# EasyEDA Pro project ProPrj_主车电路板.epro, schematic Schematic1
Board Name: 24V电源板; Create Date: 2025-03-27; Page Name: P1; Project Name: 主车电路板3.0; Schematic Name: Schematic1; Update Date: 2025-03-31; Company: 嘉立创EDA; Drawed: 李子晞; Page Size: A4; Version: V1.0
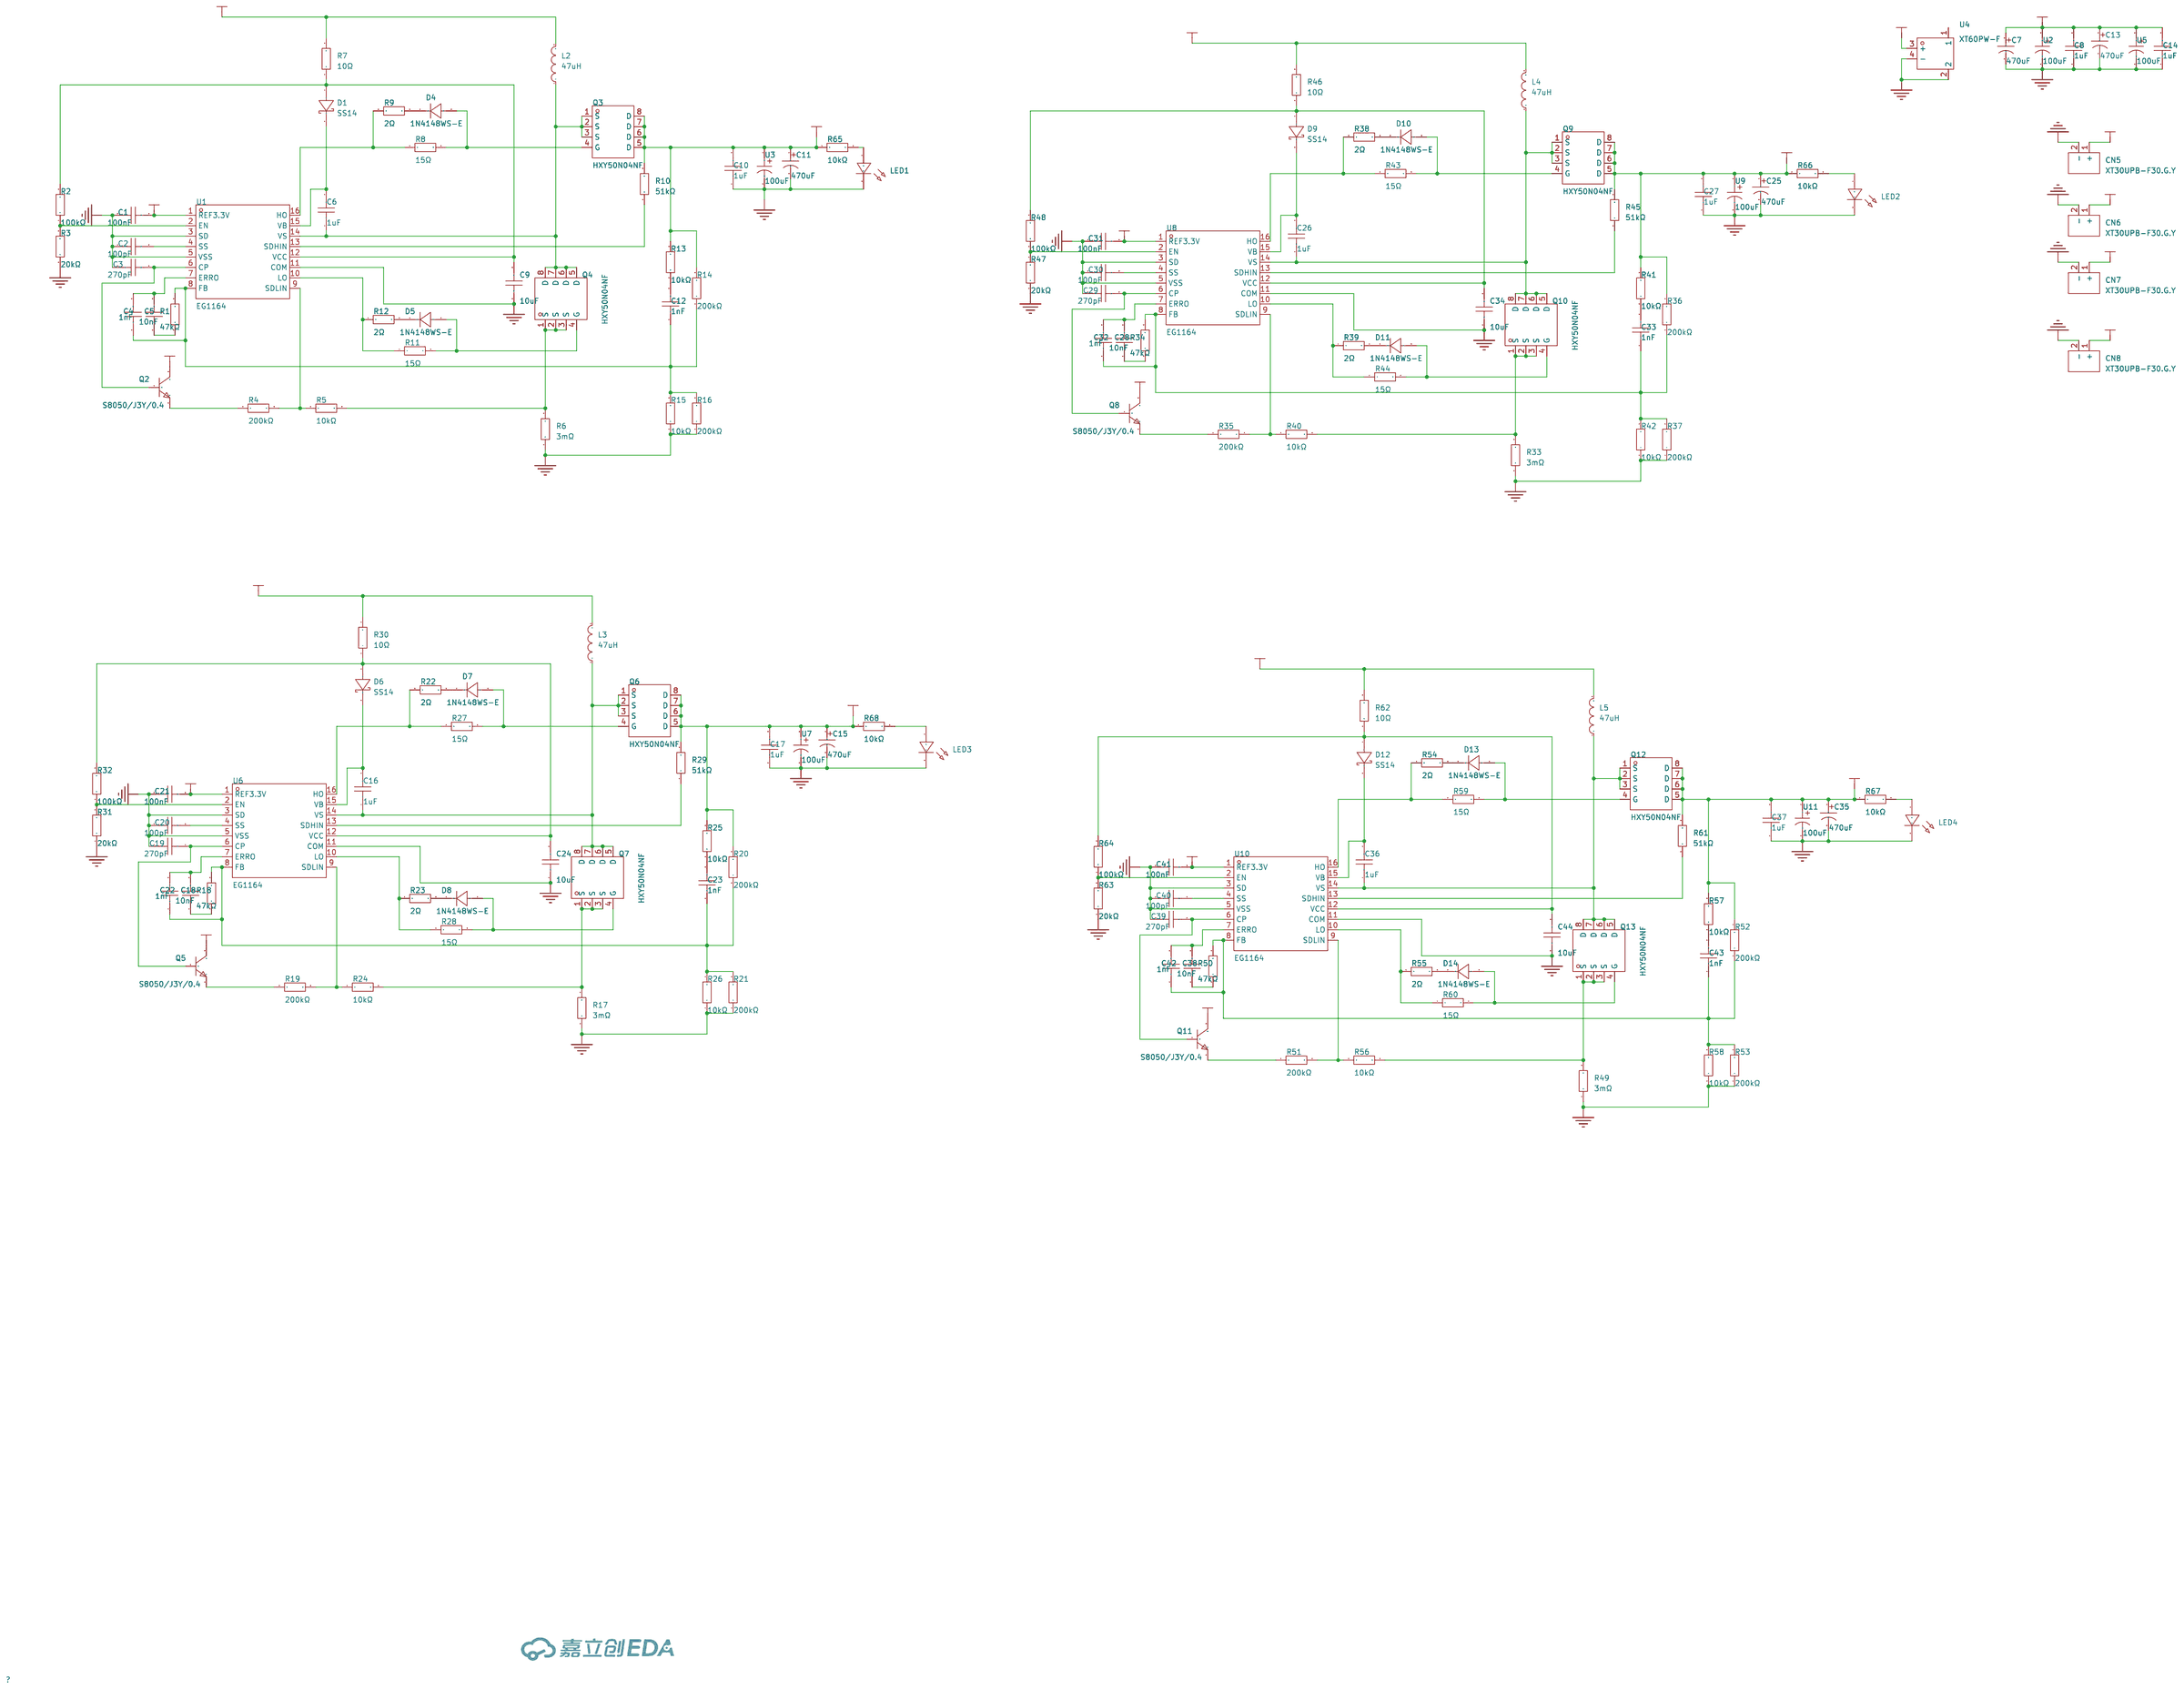
[diagram p1: schematic sheet]

## Parts
C1  100nF  [C0805]
C2  100pF  [C0805]
C3  270pF  [C0805]
C4  1nF  [C0805]
C5  10nF  [C0805]
C6  1uF  [C0805]
C7  470uF  [CAP-SMD_BD10.0-L10.3-W10.3-LS11.0-R-RD]
C8  1uF  [C0805]
C9  10uF  [C0805]
C10  1uF  [C0805]
C11  470uF  [CAP-SMD_BD10.0-L10.3-W10.3-LS11.0-R-RD]
C12  1nF  [C0805]
C13  470uF  [CAP-SMD_BD10.0-L10.3-W10.3-LS11.0-R-RD]
C14  1uF  [C0805]
C15  470uF  [CAP-SMD_BD10.0-L10.3-W10.3-LS11.0-R-RD]
C16  1uF  [C0805]
C17  1uF  [C0805]
C18  10nF  [C0805]
C19  270pF  [C0805]
C20  100pF  [C0805]
C21  100nF  [C0805]
C22  1nF  [C0805]
C23  1nF  [C0805]
C24  10uF  [C0805]
C25  470uF  [CAP-SMD_BD10.0-L10.3-W10.3-LS11.0-R-RD]
C26  1uF  [C0805]
C27  1uF  [C0805]
C28  10nF  [C0805]
C29  270pF  [C0805]
C30  100pF  [C0805]
C31  100nF  [C0805]
C32  1nF  [C0805]
C33  1nF  [C0805]
C34  10uF  [C0805]
C35  470uF  [CAP-SMD_BD10.0-L10.3-W10.3-LS11.0-R-RD]
C36  1uF  [C0805]
C37  1uF  [C0805]
C38  10nF  [C0805]
C39  270pF  [C0805]
C40  100pF  [C0805]
C41  100nF  [C0805]
C42  1nF  [C0805]
C43  1nF  [C0805]
C44  10uF  [C0805]
CN5  XT30UPB-F30.G.Y  [CONN-TH_XT30UPB-F]
CN6  XT30UPB-F30.G.Y  [CONN-TH_XT30UPB-F]
CN7  XT30UPB-F30.G.Y  [CONN-TH_XT30UPB-F]
CN8  XT30UPB-F30.G.Y  [CONN-TH_XT30UPB-F]
D1  SS14  [DO-214AC_L5.0-W2.5-LS5.0-FD]
D4  1N4148WS-E  [SOD-323_L1.8-W1.3-LS2.5-RD]
D5  1N4148WS-E  [SOD-323_L1.8-W1.3-LS2.5-RD]
D6  SS14  [DO-214AC_L5.0-W2.5-LS5.0-FD]
D7  1N4148WS-E  [SOD-323_L1.8-W1.3-LS2.5-RD]
D8  1N4148WS-E  [SOD-323_L1.8-W1.3-LS2.5-RD]
D9  SS14  [DO-214AC_L5.0-W2.5-LS5.0-FD]
D10  1N4148WS-E  [SOD-323_L1.8-W1.3-LS2.5-RD]
D11  1N4148WS-E  [SOD-323_L1.8-W1.3-LS2.5-RD]
D12  SS14  [DO-214AC_L5.0-W2.5-LS5.0-FD]
D13  1N4148WS-E  [SOD-323_L1.8-W1.3-LS2.5-RD]
D14  1N4148WS-E  [SOD-323_L1.8-W1.3-LS2.5-RD]
L2  47uH  [IND-TH_L20.0-W9.0-P8.00-D1.0]
L3  47uH  [IND-TH_L20.0-W9.0-P8.00-D1.0]
L4  47uH  [IND-TH_L20.0-W9.0-P8.00-D1.0]
L5  47uH  [IND-TH_L20.0-W9.0-P8.00-D1.0]
LED1  -  [LED_TH-3mm]
LED2  -  [LED_TH-3mm]
LED3  -  [LED_TH-3mm]
LED4  -  [LED_TH-3mm]
Q2  S8050/J3Y/0.4  [SOT-23-3_L2.9-W1.3-P1.90-LS2.4-BR]
Q3  HXY50N04NF  [PDFN-8_L6.0-W5.0-P1.27-BL-A]
Q4  HXY50N04NF  [PDFN-8_L6.0-W5.0-P1.27-BL-A]
Q5  S8050/J3Y/0.4  [SOT-23-3_L2.9-W1.3-P1.90-LS2.4-BR]
Q6  HXY50N04NF  [PDFN-8_L6.0-W5.0-P1.27-BL-A]
Q7  HXY50N04NF  [PDFN-8_L6.0-W5.0-P1.27-BL-A]
Q8  S8050/J3Y/0.4  [SOT-23-3_L2.9-W1.3-P1.90-LS2.4-BR]
Q9  HXY50N04NF  [PDFN-8_L6.0-W5.0-P1.27-BL-A]
Q10  HXY50N04NF  [PDFN-8_L6.0-W5.0-P1.27-BL-A]
Q11  S8050/J3Y/0.4  [SOT-23-3_L2.9-W1.3-P1.90-LS2.4-BR]
Q12  HXY50N04NF  [PDFN-8_L6.0-W5.0-P1.27-BL-A]
Q13  HXY50N04NF  [PDFN-8_L6.0-W5.0-P1.27-BL-A]
R1  47kΩ  [R0805]
R2  100kΩ  [R0805_NEW]
R3  20kΩ  [R0805]
R4  200kΩ  [R0805]
R5  10kΩ  [R0805]
R6  3mΩ  [R1206]
R7  10Ω  [R0805]
R8  15Ω  [R0805]
R9  2Ω  [R0805]
R10  51kΩ  [R0805]
R11  15Ω  [R0805]
R12  2Ω  [R0805]
R13  10kΩ  [R0805]
R14  200kΩ  [R0805]
R15  10kΩ  [R0805]
R16  200kΩ  [R0805]
R17  3mΩ  [R1206]
R18  47kΩ  [R0805]
R19  200kΩ  [R0805]
R20  200kΩ  [R0805]
R21  200kΩ  [R0805]
R22  2Ω  [R0805]
R23  2Ω  [R0805]
R24  10kΩ  [R0805]
R25  10kΩ  [R0805]
R26  10kΩ  [R0805]
R27  15Ω  [R0805]
R28  15Ω  [R0805]
R29  51kΩ  [R0805]
R30  10Ω  [R0805]
R31  20kΩ  [R0805]
R32  100kΩ  [R0805_NEW]
R33  3mΩ  [R1206]
R34  47kΩ  [R0805]
R35  200kΩ  [R0805]
R36  200kΩ  [R0805]
R37  200kΩ  [R0805]
R38  2Ω  [R0805]
R39  2Ω  [R0805]
R40  10kΩ  [R0805]
R41  10kΩ  [R0805]
R42  10kΩ  [R0805]
R43  15Ω  [R0805]
R44  15Ω  [R0805]
R45  51kΩ  [R0805]
R46  10Ω  [R0805]
R47  20kΩ  [R0805]
R48  100kΩ  [R0805_NEW]
R49  3mΩ  [R1206]
R50  47kΩ  [R0805]
R51  200kΩ  [R0805]
R52  200kΩ  [R0805]
R53  200kΩ  [R0805]
R54  2Ω  [R0805]
R55  2Ω  [R0805]
R56  10kΩ  [R0805]
R57  10kΩ  [R0805]
R58  10kΩ  [R0805]
R59  15Ω  [R0805]
R60  15Ω  [R0805]
R61  51kΩ  [R0805]
R62  10Ω  [R0805]
R63  20kΩ  [R0805]
R64  100kΩ  [R0805_NEW]
R65  10kΩ  [R1206]
R66  10kΩ  [R1206]
R67  10kΩ  [R1206]
R68  10kΩ  [R1206]
U1  EG1164  [SOP-16_L9.9-W3.9-P1.27-LS6.0-BL]
U2  100uF  [CAP-SMD_BD6.3-L6.6-W6.6-LS7.2-FD]
U3  100uF  [CAP-SMD_BD6.3-L6.6-W6.6-LS7.2-FD]
U4  XT60PW-F  [TH_2P-XT60PW-F]
U5  100uF  [CAP-SMD_BD6.3-L6.6-W6.6-LS7.2-FD]
U6  EG1164  [SOP-16_L9.9-W3.9-P1.27-LS6.0-BL]
U7  100uF  [CAP-SMD_BD6.3-L6.6-W6.6-LS7.2-FD]
U8  EG1164  [SOP-16_L9.9-W3.9-P1.27-LS6.0-BL]
U9  100uF  [CAP-SMD_BD6.3-L6.6-W6.6-LS7.2-FD]
U10  EG1164  [SOP-16_L9.9-W3.9-P1.27-LS6.0-BL]
U11  100uF  [CAP-SMD_BD6.3-L6.6-W6.6-LS7.2-FD]

## Library data of the parts
C1 C21 C31 C41 = CC0805KRX7R9BB104: 容值:100nF;精度:±10%;额定电压:50V;材质(温度系数):X7R;; LCSC Part Name: 100nF ±10% 50V; Supplier Part: C49678; Manufacturer: YAGEO(国巨); Supplier Footprint: 0805; JLCPCB Part Class: Basic Part; Datasheet: https://atta.szlcsc.com/upload/public/pdf/source/20180224/C181747_15194369449651363981.pdf; Supplier: LCSC; Tolerance: ±10%; Voltage Rated: 50V; Temperature Coefficient: X7R
C2 C20 C30 C40 = CC0805JRNPO9BN101: 容值:100pF;精度:±5%;额定电压:50V;材质(温度系数):NP0;; LCSC Part Name: 100pF ±5% 50V; Supplier Part: C62768; Manufacturer: YAGEO(国巨); Supplier Footprint: 0805; JLCPCB Part Class: Extended Part; Datasheet: https://atta.szlcsc.com/upload/public/pdf/source/20170505/1493957838062.pdf; Supplier: LCSC; Tolerance: ±5%; Voltage Rated: 50V; Temperature Coefficient: NP0
C3 C19 C29 C39 = CC0805JRNPO9BN271: 容值:270pF;精度:±5%;额定电压:50V;材质(温度系数):NP0;; LCSC Part Name: 270pF ±5% 50V; Supplier Part: C113828; Manufacturer: YAGEO(国巨); Supplier Footprint: 0805; JLCPCB Part Class: Extended Part; Datasheet: https://atta.szlcsc.com/upload/public/pdf/source/20170914/C128857_1505359892143968080.pdf; Supplier: LCSC; Tolerance: ±5%; Voltage Rated: 50V; Temperature Coefficient: NP0
C4 C12 C22 C23 C32 C33 C42 C43 = CC0805KRX7R9BB102: 容值:1nF;精度:±10%;额定电压:50V;材质(温度系数):X7R;; LCSC Part Name: 1nF ±10% 50V; Supplier Part: C94121; Manufacturer: YAGEO(国巨); Supplier Footprint: 0805; JLCPCB Part Class: Extended Part; Datasheet: https://atta.szlcsc.com/upload/public/pdf/source/20170211/1486785656773.pdf; Supplier: LCSC; Tolerance: ±10%; Voltage Rated: 50V; Temperature Coefficient: X7R
C5 C18 C28 C38 = CC0805KRX7R9BB103: 容值:10nF;精度:±10%;额定电压:50V;材质(温度系数):X7R;; LCSC Part Name: 10nF ±10% 50V; Supplier Part: C83170; Manufacturer: YAGEO(国巨); Supplier Footprint: 0805; JLCPCB Part Class: Extended Part; Datasheet: https://atta.szlcsc.com/upload/public/pdf/source/20170211/1486785656773.pdf; Supplier: LCSC; Tolerance: ±10%; Voltage Rated: 50V; Temperature Coefficient: X7R
C6 C8 C10 C14 C16 C17 C26 C27 C36 C37 = CC0805KKX7R9BB105: 容值:1uF;精度:±10%;额定电压:50V;材质(温度系数):X7R;; LCSC Part Name: 1uF ±10% 50V; Supplier Part: C91185; Manufacturer: YAGEO(国巨); Supplier Footprint: 0805; JLCPCB Part Class: Extended Part; Datasheet: https://atta.szlcsc.com/upload/public/pdf/source/20181008/C309510_22F155564471FAF6A489F7D68F34234E.pdf; Supplier: LCSC; Tolerance: ±10%; Voltage Rated: 50V; Temperature Coefficient: X7R
C7 C11 C13 C15 C25 C35 = RVT1V471M1010_C72519: 容值:470uF;精度:±20%;额定电压:35V;纹波电流:286mA@120Hz;等效串联电阻(ESR):-;; LCSC Part Name: 470uF ±20% 35V; Supplier Part: C72519; Manufacturer: ROQANG(容强); Manufacturer Part: RVT1V471M1010; Supplier Footprint: SMD,D10xL10.2mm; JLCPCB Part Class: Extended Part; Datasheet: https://atta.szlcsc.com/upload/public/pdf/source/20210128/C72519_A1B8ED607B11AD36B70B1D23AFC8819E.pdf; Supplier: LCSC; Tolerance: ±20%; Voltage Rating: 35V; Ripple Current: 286mA@120Hz; Diameter: 10mm; Height - Seated (Max): 10.2mm; Lifetime: 2000hrs@105℃; Operating Temperature: -40℃~+105℃
C9 C24 C34 C44 = GRM21BR61H106KE43L: 容值:10uF;精度:±10%;额定电压:50V;材质(温度系数):X5R;; LCSC Part Name: 10uF ±10% 50V; Supplier Part: C440198; Manufacturer: muRata(村田); Supplier Footprint: 0805; JLCPCB Part Class: Basic Part; Datasheet: https://atta.szlcsc.com/upload/public/pdf/source/20230811/95AAE0C9AF55EDC31B7A4D8B733F534E.pdf; Supplier: LCSC; Tolerance: ±10%; Voltage Rated: 50V; Temperature Coefficient: X5R
CN5-CN8 = XT30UPB-F30.G.Y: 类别:-;类型1:-;; LCSC Part Name: AMASS(艾迈斯)直立焊板式连接器XT30UPB30-F.G.*; Supplier Part: C108769; Manufacturer: AMASS(艾迈斯); JLCPCB Part Class: 扩展库; Datasheet: https://atta.szlcsc.com/upload/public/pdf/source/20220715/AFD68B9E8B6CA95A7295DBF4AF9325E4.pdf; Supplier: LCSC; Brand: 艾迈斯; Type: 航模插头; Colour: 黄色; RatedVoltage: DC 500V; InterfaceType: 母头; MetalMaterial: 镀金; InsulationMaterial: PA; RatedCurrent: 15A; contact resistance: 0.65mΩ
D1 D6 D9 D12 = SS14_C509048: 正向压降(Vf):550mV@1A;直流反向耐压(Vr):40V;平均整流电流(Io):1A;; LCSC Part Name: 电压:40V 电流:1A; Supplier Part: C509048; Manufacturer: Hottech(合科泰); Supplier Footprint: SMA(DO-214AC); JLCPCB Part Class: 扩展库; Datasheet: https://atta.szlcsc.com/upload/public/pdf/source/20220428/2BFFD78FFB6595E0D7CF7645C4176133.pdf; Supplier: LCSC; Forward Voltage (Vf@If): 550mV@1A; Reverse Voltage (Vr): 40V; Average Rectified Current (Io): 1A; Reverse Leakage Current (Ir): 500uA@40V
D4 D5 D7 D8 D10 D11 D13 D14 = 1N4148WS-E: 二极管配置:-;正向压降(Vf):-;直流反向耐压(Vr):-;; LCSC Part Name: 开关二极管; Supplier Part: C41371421; Manufacturer: MDD(辰达半导体); Supplier Footprint: SOD-323; JLCPCB Part Class: 扩展库; Datasheet: https://atta.szlcsc.com/upload/public/pdf/source/20240830/BA1E56105C5798AA4D5522D8577BF8A0.pdf; Supplier: LCSC
L2-L5 = XR065125T470MV1L: 电感值:47uH;精度:±10%;额定电流:7.8A;类型:磁环电感;; Supplier Part: C18213929; Manufacturer: XR(祥如); Supplier Footprint: 插件,D=20mm; JLCPCB Part Class: Extended Part; Datasheet: https://atta.szlcsc.com/upload/public/pdf/source/20231010/842403E5F9633A96AB1B00766EE4450D.pdf; Supplier: LCSC; Tolerance: ±10%; Rated Current: 7.8A; Type: 磁环电感; Wire Diameter: 1mm
LED1-LED4 = LED_TH-R_3mm: Supplier Footprint: 插件
Q2 Q5 Q8 Q11 = S8050/J3Y/0.4: 晶体管类型:NPN;集电极电流(Ic):500mA;集射极击穿电压(Vceo):25V;耗散功率(Pd):-;直流电流增益(hFE):400@100mA,1V;; Supplier Part: C5143141; Manufacturer: MOT(仁懋); Supplier Footprint: SOT-23; JLCPCB Part Class: 扩展库; Datasheet: https://atta.szlcsc.com/upload/public/pdf/source/20240219/78A732D43FD61A04D5C1F4B38FCBE817.pdf; Supplier: LCSC; type: NPN; Current - Collector(Ic): 500mA; Collector - Emitter Voltage VCEO: 25V; DC Current Gain: 400@100mA,1V; Transition frequency(fT): 100MHz; Current - Collector Cutoff: 100nA; Vce Saturation(VCE(sat)): 600mV
Q3 Q4 Q6 Q7 Q9 Q10 Q12 Q13 = HXY50N04NF: 类型:1个N沟道;漏源电压(Vdss):40V;连续漏极电流(Id):50A;导通电阻(RDS(on)@Vgs,Id):14mΩ@10V,30A;阈值电压(Vgs(th)@Id):2.5V@250uA;; LCSC Part Name: N沟道增强型MOSFET,电流:50A,耐压:40V; Supplier Part: C3033451; Manufacturer: HXY MOSFET(华轩阳电子); Supplier Footprint: DFN-8L(5x6); JLCPCB Part Class: 扩展库; Datasheet: https://atta.szlcsc.com/upload/public/pdf/source/20221215/433928C2BDB69DFDF4E8595FEF01B3C6.pdf; Supplier: LCSC; Type: 1个N沟道; Drain Source Voltage (Vdss): 40V; Continuous Drain Current (Id): 50A; Drain Source On Resistance (RDS(on)@Vgs,Id): 14mΩ@10V,30A; Gate Threshold Voltage (Vgs(th)@Id): 2.5V@250uA; Total Gate Charge (Qg@Vgs): 24nC; Input Capacitance (Ciss@Vds): 1.54nF@25V; Reverse Transfer Capacitance (Crss@Vds): 115pF; Operating Temperature: -55℃~+175℃
R1 R18 R34 R50 = 0805W8F4702T5E: 电阻类型:厚膜电阻;阻值:47kΩ;精度:±1%;功率:125mW;最大工作电压:150V;温度系数:±100ppm/℃;; LCSC Part Name: 47kΩ ±1% 125mW 厚膜电阻; Supplier Part: C17713; Manufacturer: UNI-ROYAL(厚声); Supplier Footprint: 0805; JLCPCB Part Class: Basic Part; Datasheet: https://atta.szlcsc.com/upload/public/pdf/source/20200306/C422600_1E6D84923E4A46A82E41ADD87F860B5C.pdf; Supplier: LCSC; Type: 厚膜电阻; Tolerance: ±1%; Power(Watts): 125mW; Overload Voltage (Max): 150V; Temperature Coefficient: ±100ppm/℃; Operating Temperature Range: -55℃~+155℃
R2 R32 R48 R64 = RC0805FR-07100KL: 电阻类型:厚膜电阻;阻值:100kΩ;精度:±1%;功率:125mW;最大工作电压:150V;温度系数:±100ppm/℃;; LCSC Part Name: 厚膜电阻 100kΩ ±1% 125mW; Supplier Part: C96346; Manufacturer: YAGEO(国巨); Supplier Footprint: 0805; JLCPCB Part Class: Extended Part; Datasheet: https://atta.szlcsc.com/upload/public/pdf/source/20170708/1499509500945.pdf; Supplier: LCSC; Type: 厚膜电阻; Tolerance: ±1%; Power(Watts): 125mW; Overload Voltage (Max): 150V; Temperature Coefficient: ±100ppm/℃; Operating Temperature Range: -55℃~+155℃
R3 R31 R47 R63 = RC0805FR-0720KL: 电阻类型:厚膜电阻;阻值:20kΩ;精度:±1%;功率:125mW;最大工作电压:150V;温度系数:±100ppm/℃;; LCSC Part Name: 厚膜电阻 20kΩ ±1% 125mW; Supplier Part: C114566; Manufacturer: YAGEO(国巨); Supplier Footprint: 0805; JLCPCB Part Class: Extended Part; Datasheet: https://atta.szlcsc.com/upload/public/pdf/source/20180821/C275644_0D56F95EFF785E7D9A1FEF436B37DA78.pdf; Supplier: LCSC; Type: 厚膜电阻; Tolerance: ±1%; Power(Watts): 125mW; Overload Voltage (Max): 150V; Temperature Coefficient: ±100ppm/℃; Operating Temperature Range: -55℃~+155℃
R4 R14 R16 R19-R21 R35-R37 R51-R53 = RC0805FR-07200KL: 电阻类型:厚膜电阻;阻值:200kΩ;精度:±1%;功率:125mW;最大工作电压:150V;温度系数:±100ppm/℃;; LCSC Part Name: 厚膜电阻 200kΩ ±1% 125mW; Supplier Part: C114562; Manufacturer: YAGEO(国巨); Supplier Footprint: 0805; JLCPCB Part Class: Extended Part; Datasheet: https://atta.szlcsc.com/upload/public/pdf/source/20180821/C275644_0D56F95EFF785E7D9A1FEF436B37DA78.pdf; Supplier: LCSC; Type: 厚膜电阻; Tolerance: ±1%; Power(Watts): 125mW; Overload Voltage (Max): 150V; Temperature Coefficient: ±100ppm/℃; Operating Temperature Range: -55℃~+155℃
R5 R13 R15 R24-R26 R40-R42 R56-R58 = RC0805FR-0710KL: 电阻类型:厚膜电阻;阻值:10kΩ;精度:±1%;功率:125mW;最大工作电压:150V;温度系数:±100ppm/℃;; LCSC Part Name: 厚膜电阻 10kΩ ±1% 125mW; Supplier Part: C84376; Manufacturer: YAGEO(国巨); Supplier Footprint: 0805; JLCPCB Part Class: Extended Part; Datasheet: https://atta.szlcsc.com/upload/public/pdf/source/20170708/1499509500945.pdf; Supplier: LCSC; Type: 厚膜电阻; Tolerance: ±1%; Power(Watts): 125mW; Overload Voltage (Max): 150V; Temperature Coefficient: ±100ppm/℃; Operating Temperature Range: -55℃~+155℃
R6 R17 R33 R49 = HoLR1206-1W-3mR-1%-75ppm: 电阻类型:采样电阻;阻值:3mΩ;精度:±1%;功率:1W;温度系数:±75ppm/℃;安装方式:贴片;; LCSC Part Name: 3mΩ ±1% 1W; Supplier Part: C601095; Manufacturer: Milliohm(毫欧); Supplier Footprint: 1206; JLCPCB Part Class: Extended Part; Datasheet: https://atta.szlcsc.com/upload/public/pdf/source/20200610/C601095_3D352933543F6BA76746E7FBED6185DD.pdf; Supplier: LCSC; Type: 采样电阻; Tolerance: ±1%; Power(Watts): 1W; Temperature Coefficient: ±75ppm/℃; Mounting Sytle: 贴片
R7 R30 R46 R62 = RC0805FR-0710RL: 电阻类型:厚膜电阻;阻值:10Ω;精度:±1%;功率:125mW;最大工作电压:150V;温度系数:±200ppm/℃;; LCSC Part Name: 厚膜电阻 10Ω ±1% 125mW; Supplier Part: C96347; Manufacturer: YAGEO(国巨); Supplier Footprint: 0805; JLCPCB Part Class: Extended Part; Datasheet: https://atta.szlcsc.com/upload/public/pdf/source/20170815/C125758_1502799027253889202.pdf; Supplier: LCSC; Type: 厚膜电阻; Tolerance: ±1%; Power(Watts): 125mW; Overload Voltage (Max): 150V; Temperature Coefficient: ±200ppm/℃; Operating Temperature Range: -55℃~+155℃
R8 R11 R27 R28 R43 R44 R59 R60 = RT0805BRE0715RL: 电阻类型:薄膜电阻;阻值:15Ω;精度:±0.1%;功率:125mW;最大工作电压:150V;温度系数:±50ppm/℃;; LCSC Part Name: 薄膜电阻 15Ω ±0.1% 125mW; Supplier Part: C706259; Manufacturer: YAGEO(国巨); Supplier Footprint: 0805; JLCPCB Part Class: Extended Part; Datasheet: https://atta.szlcsc.com/upload/public/pdf/source/20200720/C706259_2F2301666A28980AE85D5687CDDC0A3F.pdf; Supplier: LCSC; Type: 薄膜电阻; Tolerance: ±0.1%; Power(Watts): 125mW; Overload Voltage (Max): 150V; Temperature Coefficient: ±50ppm/℃; Operating Temperature Range: -55℃~+155℃
R9 R12 R22 R23 R38 R39 R54 R55 = RC0805FR-072RL: 电阻类型:厚膜电阻;阻值:2Ω;精度:±1%;功率:125mW;最大工作电压:150V;温度系数:±200ppm/℃;; LCSC Part Name: 厚膜电阻 2Ω ±1% 125mW; Supplier Part: C114246; Manufacturer: YAGEO(国巨); Supplier Footprint: 0805; JLCPCB Part Class: Extended Part; Datasheet: https://atta.szlcsc.com/upload/public/pdf/source/20180821/C275644_0D56F95EFF785E7D9A1FEF436B37DA78.pdf; Supplier: LCSC; Type: 厚膜电阻; Tolerance: ±1%; Power(Watts): 125mW; Overload Voltage (Max): 150V; Temperature Coefficient: ±200ppm/℃; Operating Temperature Range: -55℃~+155℃
R10 R29 R45 R61 = RC0805FR-0751KL: 电阻类型:厚膜电阻;阻值:51kΩ;精度:±1%;功率:125mW;最大工作电压:150V;温度系数:±100ppm/℃;; LCSC Part Name: 厚膜电阻 51kΩ ±1% 125mW; Supplier Part: C107233; Manufacturer: YAGEO(国巨); Supplier Footprint: 0805; JLCPCB Part Class: Extended Part; Datasheet: https://atta.szlcsc.com/upload/public/pdf/source/20180821/C275644_0D56F95EFF785E7D9A1FEF436B37DA78.pdf; Supplier: LCSC; Type: 厚膜电阻; Tolerance: ±1%; Power(Watts): 125mW; Overload Voltage (Max): 150V; Temperature Coefficient: ±100ppm/℃; Operating Temperature Range: -55℃~+155℃
R65-R68 = FRP1206J103 TS: 电阻类型:厚膜电阻;阻值:10kΩ;精度:±5%;功率:500mW;最大工作电压:200V;温度系数:±200ppm/℃;; LCSC Part Name: 10kΩ ±5% 500mW 厚膜电阻; Supplier Part: C3013377; Manufacturer: FOJAN(富捷); Supplier Footprint: 1206; JLCPCB Part Class: Extended Part; Datasheet: https://atta.szlcsc.com/upload/public/pdf/source/20211221/925EC7D7225764EE0046F22065062C87.pdf; Supplier: LCSC; Type: 厚膜电阻; Tolerance: ±5%; Power(Watts): 500mW; Overload Voltage (Max): 200V; Temperature Coefficient: ±200ppm/℃
U1 U6 U8 U10 = EG1164: 功能类型:升压型;输出类型:-;工作电压:-;输出电压:-;输出电流:-;; LCSC Part Name: 升压型同步整流电源芯片; Supplier Part: C2987434; Manufacturer: EG(屹晶微); Supplier Footprint: SOP-16; JLCPCB Part Class: 扩展库; Datasheet: https://atta.szlcsc.com/upload/public/pdf/source/20220331/0031AB6D1B81CE74DEC4FA72EA357130.pdf; Supplier: LCSC; Function: 升压型; Operating Temperature: -45℃~+125℃; Synchronous Rectification: 是; Number of Outputs: 1; Topology: 升压式
U2 = RST100UF35V009: 容值:100uF;精度:±20%;额定电压:35V;纹波电流:84mA@120Hz;等效串联电阻(ESR):-;; LCSC Part Name: 100uF ±20% 35V; Supplier Part: C4747966; Manufacturer: KNSCHA(科尼盛); Supplier Footprint: SMD,D6.3xL7.7mm; JLCPCB Part Class: Extended Part; Datasheet: https://atta.szlcsc.com/upload/public/pdf/source/20220728/EE5FCA44287011E134FD5BDD3E8B91F9.pdf; Supplier: LCSC; Tolerance: ±20%; Voltage Rating: 35V; Ripple Current: 84mA@120Hz; Diameter: 6.3mm; Height - Seated (Max): 7.7mm; Lifetime: 2000hrs@105℃; Operating Temperature: -40℃~+105℃
U3 U5 U7 U9 U11 = RST100UF35V009: 容值:100uF;精度:±20%;额定电压:35V;纹波电流:84mA@120Hz;等效串联电阻(ESR):-;; LCSC Part Name: 100uF ±20% 35V; Supplier Part: C4747966; Manufacturer: KNSCHA(科尼盛); Supplier Footprint: SMD,D6.3xL7.7mm; JLCPCB Part Class: 扩展库; Datasheet: https://atta.szlcsc.com/upload/public/pdf/source/20220728/EE5FCA44287011E134FD5BDD3E8B91F9.pdf; Supplier: LCSC; Tolerance: ±20%; Voltage Rating: 35V; Ripple Current: 84mA@120Hz; Diameter: 6.3mm; Height - Seated (Max): 7.7mm; Lifetime: 2000hrs@105℃; Operating Temperature: -40℃~+105℃
U4 = XT60PW-F: 类别:-;类型1:-;; LCSC Part Name: AMASS(艾迈斯)插头连接器锂电池组充电接口 航模电调卧式焊板 母头 XT60PW-F; Supplier Part: C428722; Manufacturer: AMASS(艾迈斯); JLCPCB Part Class: 扩展库; Datasheet: https://atta.szlcsc.com/upload/public/pdf/source/20190916/C428722_DFF78979486FCB0B58C1FC563067EC88.pdf; Supplier: LCSC; Type: 卧式插头; Colour: 黄色; InterfaceType: 母头

## Nets
+3.3V: C1.2 Q2.3(C) U1.1(REF3.3V)
+16.8V: C7.1 C8.2 C13.1 C14.2 L2.2 L3.2 L4.2 L5.2 R7.2 R30.2 R46.2 R62.2 U2.1 U4.3(+) U5.1
GND: C1.1 C2.1 C3.1 C7.2 C8.1 C9.1 C10.1 C11.2 C13.2 C14.1 C15.2 C17.1 C19.1 C20.1 C21.1 C24.1 C25.2 C27.1 C29.1 C30.1 C31.1 C34.1 C35.2 C37.1 C39.1 C40.1 C41.1 C44.1 CN5.2(-) CN6.2(-) CN7.2(-) CN8.2(-) LED1.2(A) LED2.2(A) LED3.2(A) LED4.2(A) R3.1 R6.1 R15.1 R16.1 R17.1 R21.1 R26.1 R31.1 R33.1 R37.1 R42.1 R47.1 R49.1 R53.1 R58.1 R63.1 U1.3(SD) U1.5(VSS) U1.11(COM) U2.2 U3.2 U4.2 U4.4(-) U5.2 U6.3(SD) U6.5(VSS) U6.11(COM) U7.2 U8.3(SD) U8.5(VSS) U8.11(COM) U9.2 U10.3(SD) U10.5(VSS) U10.11(COM) U11.2
REF3.3V-2: C31.2 Q8.3(C) U8.1(REF3.3V)
REF3.3V-3: C21.2 Q5.3(C) U6.1(REF3.3V)
REF3.3V-4: C41.2 Q11.3(C) U10.1(REF3.3V)
VOUT1: C10.2 C11.1 CN5.1(+) Q3.5(D) Q3.6(D) Q3.7(D) Q3.8(D) R10.2 R13.2 R14.2 R65.1 U3.1
VOUT2: C25.1 C27.2 CN6.1(+) Q9.5(D) Q9.6(D) Q9.7(D) Q9.8(D) R36.2 R41.2 R45.2 R66.1 U9.1
VOUT3: C15.1 C17.2 CN7.1(+) Q6.5(D) Q6.6(D) Q6.7(D) Q6.8(D) R20.2 R25.2 R29.2 R68.1 U7.1
VOUT4: C35.1 C37.2 CN8.1(+) Q12.5(D) Q12.6(D) Q12.7(D) Q12.8(D) R52.2 R57.2 R61.2 R67.1 U11.1
$1N587: C2.2 U1.4(SS)
$1N613: C3.2 Q2.1(B) U1.6(CP)
$1N810: C4.2 C5.2 U1.7(ERRO)
$1N1003: C5.1 R1.1
$1N1020: R2.1 R3.2 U1.2(EN)
$1N1118: Q2.2(E) R4.1
$1N1194: R4.2 R5.1 U1.9(SDLIN)
$1N1198: Q4.1(S) Q4.2(S) Q4.3(S) R5.2 R6.2
$1N1234: C9.2 D1.1(A) R2.2 R7.1 U1.12(VCC)
$1N1468: C6.2 D1.2(K) U1.15(VB)
$1N1730: D4.1(K) R9.2
$1N2143: R8.1 R9.1 U1.16(HO)
$1N2257: D4.2(A) Q3.4(G) R8.2
$1N2454: C6.1 L2.1 Q3.1(S) Q3.2(S) Q3.3(S) Q4.5(D) Q4.6(D) Q4.7(D) Q4.8(D) U1.14(VS)
$1N2537: R10.1 U1.13(SDHIN)
$1N2739: D5.2(A) Q4.4(G) R11.2
$1N2745: R11.1 R12.1 U1.10(LO)
$1N2749: D5.1(K) R12.2
$1N3054: C12.2 R13.1
$1N3114: C4.1 C12.1 R1.2 R14.1 R15.2 R16.2 U1.8(FB)
$1N10505: C16.1 L3.1 Q6.1(S) Q6.2(S) Q6.3(S) Q7.5(D) Q7.6(D) Q7.7(D) Q7.8(D) U6.14(VS)
$1N10518: D7.2(A) Q6.4(G) R27.2
$1N10523: D7.1(K) R22.2
$1N10529: C24.2 D6.1(A) R30.1 R32.2 U6.12(VCC)
$1N10537: C23.2 R25.1
$1N10539: R29.1 U6.13(SDHIN)
$1N10542: Q7.1(S) Q7.2(S) Q7.3(S) R17.2 R24.2
$1N10551: D8.2(A) Q7.4(G) R28.2
$1N10557: R23.1 R28.1 U6.10(LO)
$1N10562: D8.1(K) R23.2
$1N10564: R19.2 R24.1 U6.9(SDLIN)
$1N10568: C22.1 C23.1 R18.2 R20.1 R21.2 R26.2 U6.8(FB)
$1N10586: R22.1 R27.1 U6.16(HO)
$1N10591: C16.2 D6.2(K) U6.15(VB)
$1N10609: Q5.2(E) R19.1
$1N10613: C18.2 C22.2 U6.7(ERRO)
$1N10618: C20.2 U6.4(SS)
$1N10620: C19.2 Q5.1(B) U6.6(CP)
$1N10634: R31.2 R32.1 U6.2(EN)
$1N10636: C18.1 R18.1
$1N12142: R38.1 R43.1 U8.16(HO)
$1N12147: C26.1 L4.1 Q9.1(S) Q9.2(S) Q9.3(S) Q10.5(D) Q10.6(D) Q10.7(D) Q10.8(D) U8.14(VS)
$1N12160: D10.2(A) Q9.4(G) R43.2
$1N12165: D10.1(K) R38.2
$1N12167: C29.2 Q8.1(B) U8.6(CP)
$1N12177: C26.2 D9.2(K) U8.15(VB)
$1N12190: Q10.1(S) Q10.2(S) Q10.3(S) R33.2 R40.2
$1N12195: C30.2 U8.4(SS)
$1N12199: C33.2 R41.1
$1N12201: R45.1 U8.13(SDHIN)
$1N12204: C34.2 D9.1(A) R46.1 R48.2 U8.12(VCC)
$1N12212: C28.2 C32.2 U8.7(ERRO)
$1N12217: C32.1 C33.1 R34.2 R36.1 R37.2 R42.2 U8.8(FB)
$1N12230: D11.2(A) Q10.4(G) R44.2
$1N12236: D11.1(K) R39.2
$1N12238: R39.1 R44.1 U8.10(LO)
$1N12243: C28.1 R34.1
$1N12250: Q8.2(E) R35.1
$1N12252: R35.2 R40.1 U8.9(SDLIN)
$1N12258: R47.2 R48.1 U8.2(EN)
$1N13775: R54.1 R59.1 U10.16(HO)
$1N13780: C36.1 L5.1 Q12.1(S) Q12.2(S) Q12.3(S) Q13.5(D) Q13.6(D) Q13.7(D) Q13.8(D) U10.14(VS)
$1N13793: D13.2(A) Q12.4(G) R59.2
$1N13798: D13.1(K) R54.2
$1N13800: C39.2 Q11.1(B) U10.6(CP)
$1N13810: C36.2 D12.2(K) U10.15(VB)
$1N13823: Q13.1(S) Q13.2(S) Q13.3(S) R49.2 R56.2
$1N13828: C40.2 U10.4(SS)
$1N13832: C43.2 R57.1
$1N13834: R61.1 U10.13(SDHIN)
$1N13837: C44.2 D12.1(A) R62.1 R64.2 U10.12(VCC)
$1N13845: C38.2 C42.2 U10.7(ERRO)
$1N13850: C42.1 C43.1 R50.2 R52.1 R53.2 R58.2 U10.8(FB)
$1N13863: D14.2(A) Q13.4(G) R60.2
$1N13869: D14.1(K) R55.2
$1N13871: R55.1 R60.1 U10.10(LO)
$1N13876: C38.1 R50.1
$1N13883: Q11.2(E) R51.1
$1N13885: R51.2 R56.1 U10.9(SDLIN)
$1N13891: R63.2 R64.1 U10.2(EN)
$1N22659: LED1.1(C) R65.2
$1N22712: LED2.1(C) R66.2
$1N22765: LED4.1(C) R67.2
$1N22818: LED3.1(C) R68.2

Not connected (* = marked no-connect by the designer): U4 1
